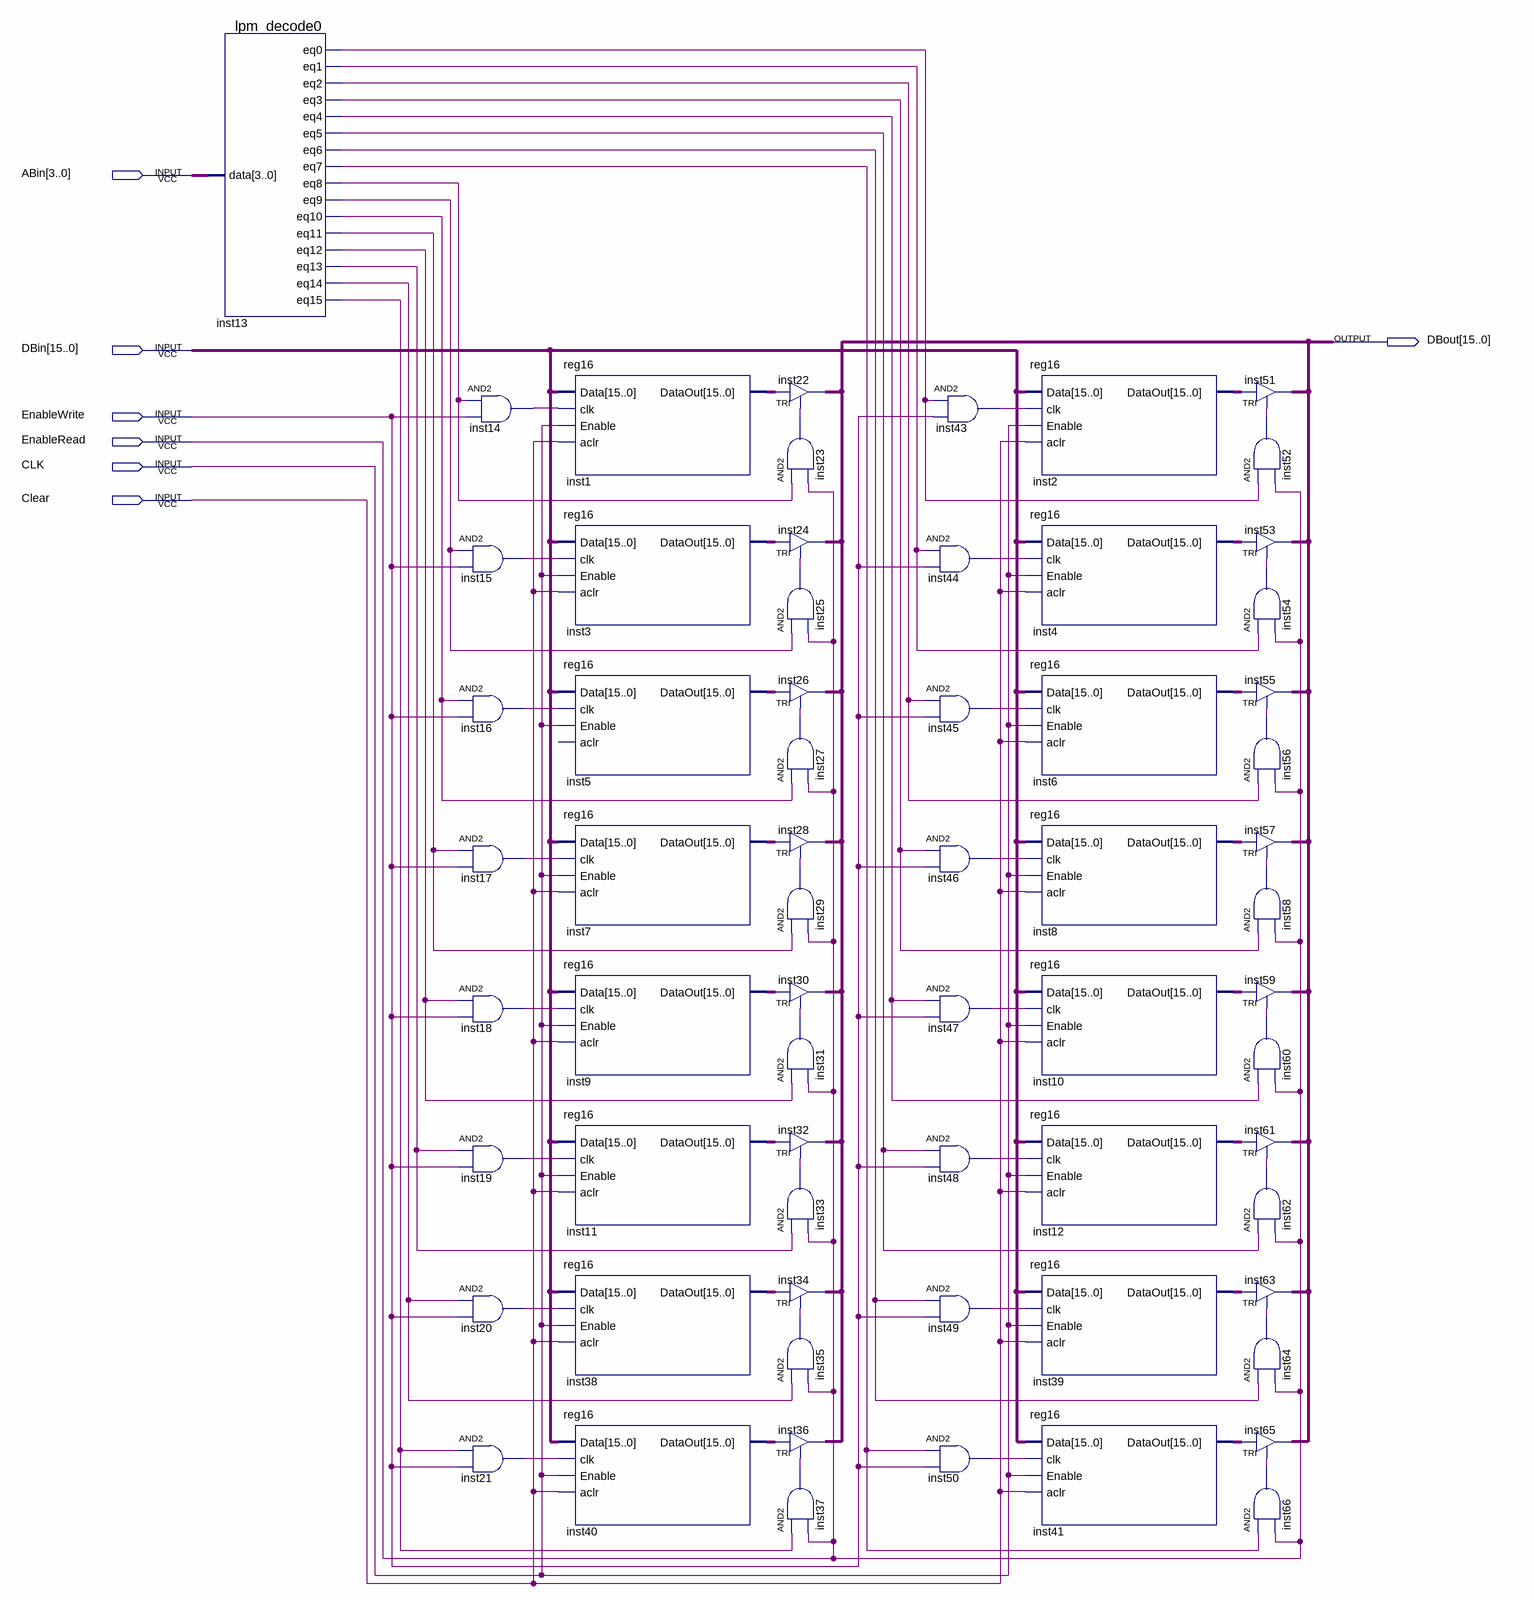
[diagram p0: schematic sheet]
// Quartus schematic registerSet.bdf as structural Verilog: 65 symbols, 7 pins
module registerSet (
  input  [3:0] ABin,
  input  [15:0] DBin,
  input  EnableWrite,
  input  EnableRead,
  input  CLK,
  input  Clear,
  output [15:0] DBout
);

  wire inst13_eq0, inst13_eq1, inst13_eq2, inst13_eq3, inst13_eq4, inst13_eq5, inst13_eq6, inst13_eq7,
       inst13_eq8, inst13_eq9, inst13_eq10, inst13_eq11, inst13_eq12, inst13_eq13, inst13_eq14, inst13_eq15,
       inst14_out, inst15_out, inst16_out, inst17_out, inst18_out, inst19_out, inst20_out, inst21_out,
       inst23_out, inst25_out, inst27_out, inst29_out, inst31_out, inst33_out, inst35_out, inst37_out,
       inst43_out, inst44_out, inst45_out, inst46_out, inst47_out, inst48_out, inst49_out, inst50_out,
       inst52_out, inst54_out, inst56_out, inst58_out, inst60_out, inst62_out, inst64_out, inst66_out;
  wire [15:0] inst1_dataout, inst2_dataout, inst3_dataout, inst4_dataout, inst5_dataout, inst6_dataout,
       inst7_dataout, inst8_dataout, inst9_dataout, inst10_dataout, inst11_dataout, inst12_dataout,
       inst38_dataout, inst39_dataout, inst40_dataout, inst41_dataout;

  lpm_decode0 inst13 (
    .data(ABin), .eq0(inst13_eq0), .eq1(inst13_eq1), .eq2(inst13_eq2), .eq3(inst13_eq3), .eq4(inst13_eq4),
    .eq5(inst13_eq5), .eq6(inst13_eq6), .eq7(inst13_eq7), .eq8(inst13_eq8), .eq9(inst13_eq9),
    .eq10(inst13_eq10), .eq11(inst13_eq11), .eq12(inst13_eq12), .eq13(inst13_eq13), .eq14(inst13_eq14),
    .eq15(inst13_eq15));
  and inst14 (inst14_out, inst13_eq8, EnableWrite);
  and inst15 (inst15_out, inst13_eq9, EnableWrite);
  and inst16 (inst16_out, inst13_eq10, EnableWrite);
  and inst17 (inst17_out, inst13_eq11, EnableWrite);
  and inst18 (inst18_out, inst13_eq12, EnableWrite);
  and inst19 (inst19_out, inst13_eq13, EnableWrite);
  and inst20 (inst20_out, inst13_eq14, EnableWrite);
  and inst21 (inst21_out, inst13_eq15, EnableWrite);
  reg16 inst1 (.Data(DBin), .clk(inst14_out), .Enable(CLK), .aclr(Clear), .DataOut(inst1_dataout));
  reg16 inst3 (.Data(DBin), .clk(inst15_out), .Enable(CLK), .aclr(Clear), .DataOut(inst3_dataout));
  reg16 inst5 (.Data(DBin), .clk(inst16_out), .Enable(CLK), .DataOut(inst5_dataout));  // open: aclr
  reg16 inst7 (.Data(DBin), .clk(inst17_out), .Enable(CLK), .aclr(Clear), .DataOut(inst7_dataout));
  reg16 inst9 (.Data(DBin), .clk(inst18_out), .Enable(CLK), .aclr(Clear), .DataOut(inst9_dataout));
  reg16 inst11 (.Data(DBin), .clk(inst19_out), .Enable(CLK), .aclr(Clear), .DataOut(inst11_dataout));
  reg16 inst38 (.Data(DBin), .clk(inst20_out), .Enable(CLK), .aclr(Clear), .DataOut(inst38_dataout));
  reg16 inst40 (.Data(DBin), .clk(inst21_out), .Enable(CLK), .aclr(Clear), .DataOut(inst40_dataout));
  TRI inst22[15:0] (.IN(inst1_dataout), .OE(inst23_out), .OUT(DBout));
  and inst23 (inst23_out, inst13_eq8, EnableRead);
  TRI inst24[15:0] (.IN(inst3_dataout), .OE(inst25_out), .OUT(DBout));
  and inst25 (inst25_out, inst13_eq9, EnableRead);
  TRI inst26[15:0] (.IN(inst5_dataout), .OE(inst27_out), .OUT(DBout));
  and inst27 (inst27_out, inst13_eq10, EnableRead);
  TRI inst28[15:0] (.IN(inst7_dataout), .OE(inst29_out), .OUT(DBout));
  and inst29 (inst29_out, inst13_eq11, EnableRead);
  TRI inst30[15:0] (.IN(inst9_dataout), .OE(inst31_out), .OUT(DBout));
  and inst31 (inst31_out, inst13_eq12, EnableRead);
  TRI inst32[15:0] (.IN(inst11_dataout), .OE(inst33_out), .OUT(DBout));
  and inst33 (inst33_out, inst13_eq13, EnableRead);
  TRI inst34[15:0] (.IN(inst38_dataout), .OE(inst35_out), .OUT(DBout));
  and inst35 (inst35_out, inst13_eq14, EnableRead);
  TRI inst36[15:0] (.IN(inst40_dataout), .OE(inst37_out), .OUT(DBout));
  and inst37 (inst37_out, inst13_eq15, EnableRead);
  and inst43 (inst43_out, inst13_eq0, EnableWrite);
  and inst44 (inst44_out, inst13_eq1, EnableWrite);
  and inst45 (inst45_out, inst13_eq2, EnableWrite);
  and inst46 (inst46_out, inst13_eq3, EnableWrite);
  and inst47 (inst47_out, inst13_eq4, EnableWrite);
  and inst48 (inst48_out, inst13_eq5, EnableWrite);
  and inst49 (inst49_out, inst13_eq6, EnableWrite);
  and inst50 (inst50_out, inst13_eq7, EnableWrite);
  reg16 inst2 (.Data(DBin), .clk(inst43_out), .Enable(CLK), .aclr(Clear), .DataOut(inst2_dataout));
  reg16 inst4 (.Data(DBin), .clk(inst44_out), .Enable(CLK), .aclr(Clear), .DataOut(inst4_dataout));
  reg16 inst6 (.Data(DBin), .clk(inst45_out), .Enable(CLK), .aclr(Clear), .DataOut(inst6_dataout));
  reg16 inst8 (.Data(DBin), .clk(inst46_out), .Enable(CLK), .aclr(Clear), .DataOut(inst8_dataout));
  reg16 inst10 (.Data(DBin), .clk(inst47_out), .Enable(CLK), .aclr(Clear), .DataOut(inst10_dataout));
  reg16 inst12 (.Data(DBin), .clk(inst48_out), .Enable(CLK), .aclr(Clear), .DataOut(inst12_dataout));
  reg16 inst39 (.Data(DBin), .clk(inst49_out), .Enable(CLK), .aclr(Clear), .DataOut(inst39_dataout));
  reg16 inst41 (.Data(DBin), .clk(inst50_out), .Enable(CLK), .aclr(Clear), .DataOut(inst41_dataout));
  TRI inst51[15:0] (.IN(inst2_dataout), .OE(inst52_out), .OUT(DBout));
  and inst52 (inst52_out, inst13_eq0, EnableRead);
  TRI inst53[15:0] (.IN(inst4_dataout), .OE(inst54_out), .OUT(DBout));
  and inst54 (inst54_out, inst13_eq1, EnableRead);
  TRI inst55[15:0] (.IN(inst6_dataout), .OE(inst56_out), .OUT(DBout));
  and inst56 (inst56_out, inst13_eq2, EnableRead);
  TRI inst57[15:0] (.IN(inst8_dataout), .OE(inst58_out), .OUT(DBout));
  and inst58 (inst58_out, inst13_eq3, EnableRead);
  TRI inst59[15:0] (.IN(inst10_dataout), .OE(inst60_out), .OUT(DBout));
  and inst60 (inst60_out, inst13_eq4, EnableRead);
  TRI inst61[15:0] (.IN(inst12_dataout), .OE(inst62_out), .OUT(DBout));
  and inst62 (inst62_out, inst13_eq5, EnableRead);
  TRI inst63[15:0] (.IN(inst39_dataout), .OE(inst64_out), .OUT(DBout));
  and inst64 (inst64_out, inst13_eq6, EnableRead);
  TRI inst65[15:0] (.IN(inst41_dataout), .OE(inst66_out), .OUT(DBout));
  and inst66 (inst66_out, inst13_eq7, EnableRead);
endmodule
